# Altium schematic sheet JTAG_connector2.SchDoc
size A
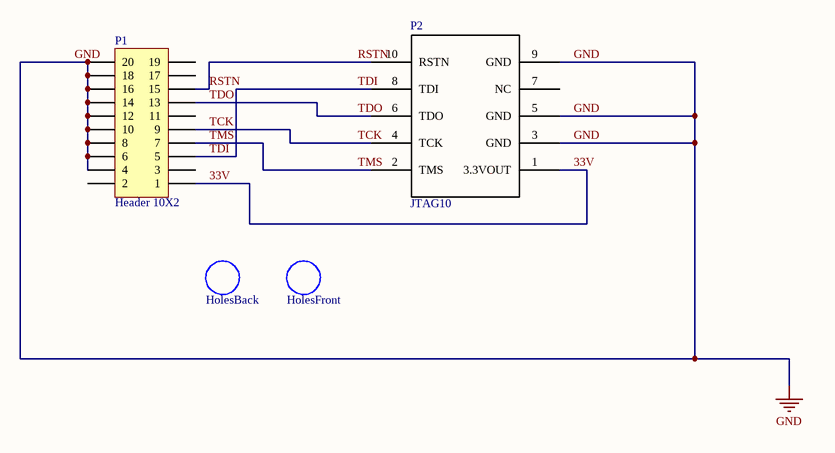
[diagram p0: JTAG_connector2.SchDoc]

## Parts
HolesBack  non connect  [3/8"Caster]  (value not drawn)
HolesFront  non connect  [3/8"Caster]  (value not drawn)
P1  Header 10X2  [HDR2X10]
P2  JTAG10  [JTAG-10]

## Nets
GND: P1.4 P1.6 P1.8 P1.10 P1.12 P1.14 P1.16 P1.18 P1.20 P2.3(GND) P2.5(GND) P2.9(GND)
33V: P1.1 P2.1(3.3VOUT)
RSTN: P1.15 P2.10(RSTN)
TCK: P1.9 P2.4(TCK)
TDI: P1.5 P2.8(TDI)
TDO: P1.13 P2.6(TDO)
TMS: P1.7 P2.2(TMS)

Not connected (* = marked no-connect by the designer): P1 2 3 11 17 19; P2 7(NC)

## Library data of the parts
HolesBack HolesFront = Caster: This is just a space saver to get the caster onto the pcb
P1 = Header 10X2: Header, 20-Pin, Dual row; LatestRevisionDate: 17-Jul-2002; LatestRevisionNote: Re-released for DXP Platform.; Publisher: Altium Limited